# EAGLE design taller_pcb (EAGLE 9.2.1)
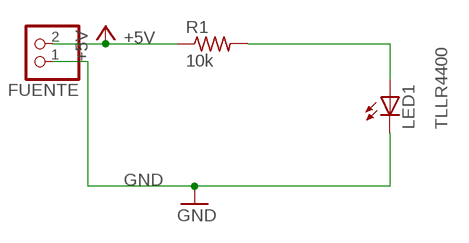
[diagram p0: schematic, sheet 1]

## Parts
FUENTE  PINHD-1X2  [1X02]
LED1  TLLR4400  [LED3MM]
R1  10k  R-US_0309/12  [0309/12]

## Nets
+5V: FUENTE.2 R1.1
GND: FUENTE.1 LED1.K(C)
N$2: LED1.A R1.2

## Library data of the parts
FUENTE = pinhead:PINHD-1X2: PIN HEADER
LED1 = led:TLLR4400: Low Current (2mA) LED 3 mm Tinted Diffused Package color RED Source: Data sheet <http://www.farnell.com/datasheets/391100.pdf>; MF: VISHAY SEMICONDUCTOR; OC_FARNELL: 1612437
R1 = rcl:R-US_: RESISTOR, American symbol; SPICEPREFIX: R

## Board
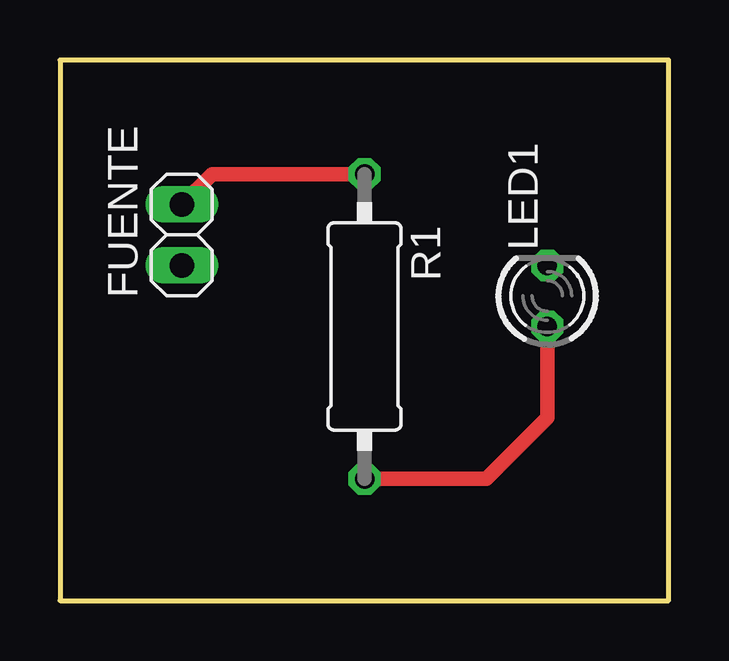
[diagram p1: board, top side]
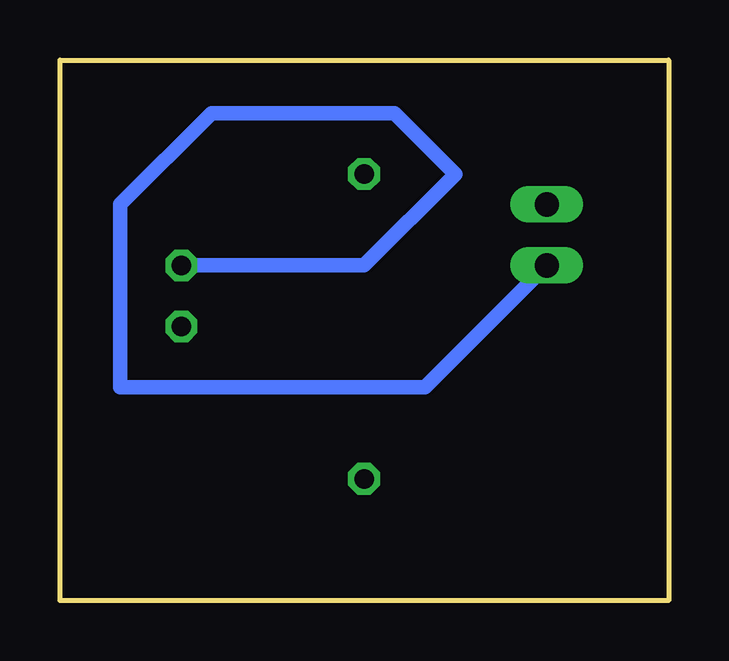
[diagram p2: board, bottom side, seen from below]

Size 25.38 x 22.53 mm. Coordinates in mm from the lower left corner, seen from the top.
Outline: 0,0 25.38,0 25.38,22.53 0,22.53 0,0
Copper layers (1*16): Top 0.035mm / dielectric 1.5mm / Bottom 0.035mm
Design rules "default": minimum track width 6mil, minimum drill 0.35mm, track to track 6mil, track to pad 6mil, pad to pad 6mil, via to via 6mil, smd to smd 6mil, copper to edge 40mil, drill to drill 6mil, minimum pad ring 10mil, minimum via ring 8mil, stop-mask expansion 4mil, vias tented up to drill 0mil, thermal gap 10mil

### Footprints (pad centres in the part's own frame; a part is rotated, then mirrored left to right if it is on the bottom)
1X02 = drill 1.016 long: 1 -1.27,0; 2 1.27,0
LED3MM = drill 0.813 octagon: A -1.27,0; K 1.27,0
0309/12 = drill 0.813 octagon: 1 -6.35,0; 2 6.35,0

### Placement (x,y rotation side)
FUENTE  5.08,15.24 90 top
LED1  20.32,12.7 90 top
R1  12.7,11.43 270 top

### Tracks (layer width: path | path; a pad name or v marks a point on that pad's centre or on a via)
+5V
  Top 0.61: FUENTE.2 6.35,17.78 R1.1
GND
  Bottom 0.61: FUENTE.1 10.16,8.89 22.86,8.89 22.86,16.51 19.05,20.32 11.43,20.32 8.89,17.78 12.7,13.97 LED1.K
N$2
  Top 0.61: R1.2 17.78,5.08 20.32,7.62 LED1.A